# Altium schematic sheet Main.SchDoc
size 711 x 762 mm; SheetNumber: 1; SheetTotal: 1
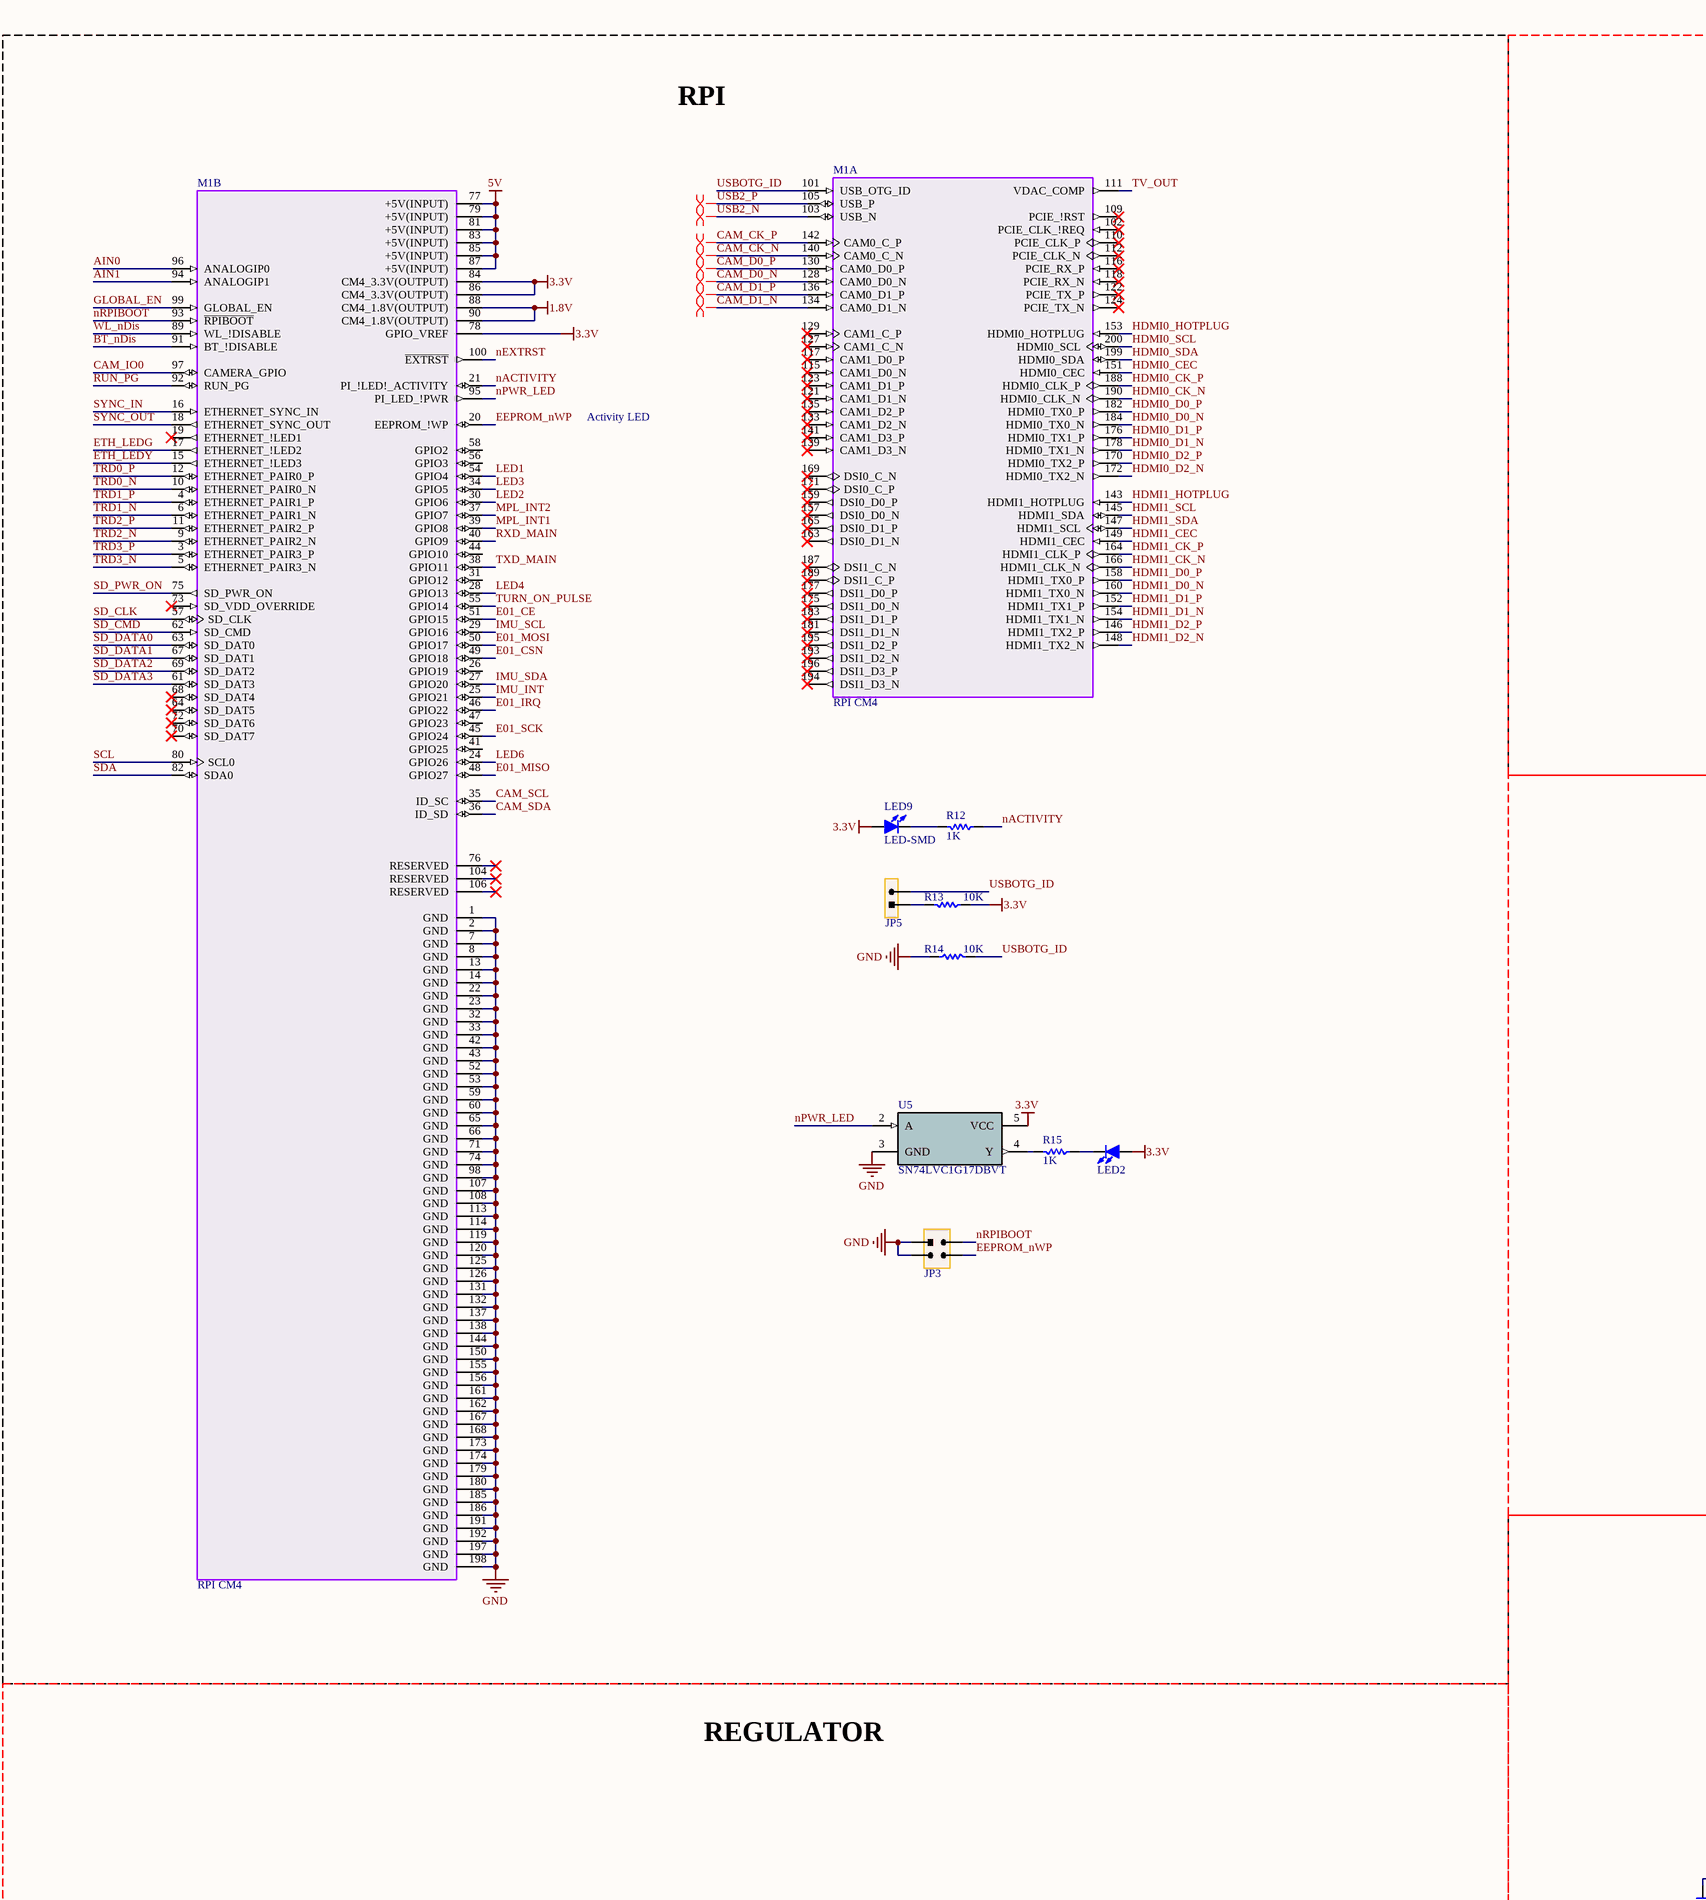
[diagram p0: Main.SchDoc, top left]
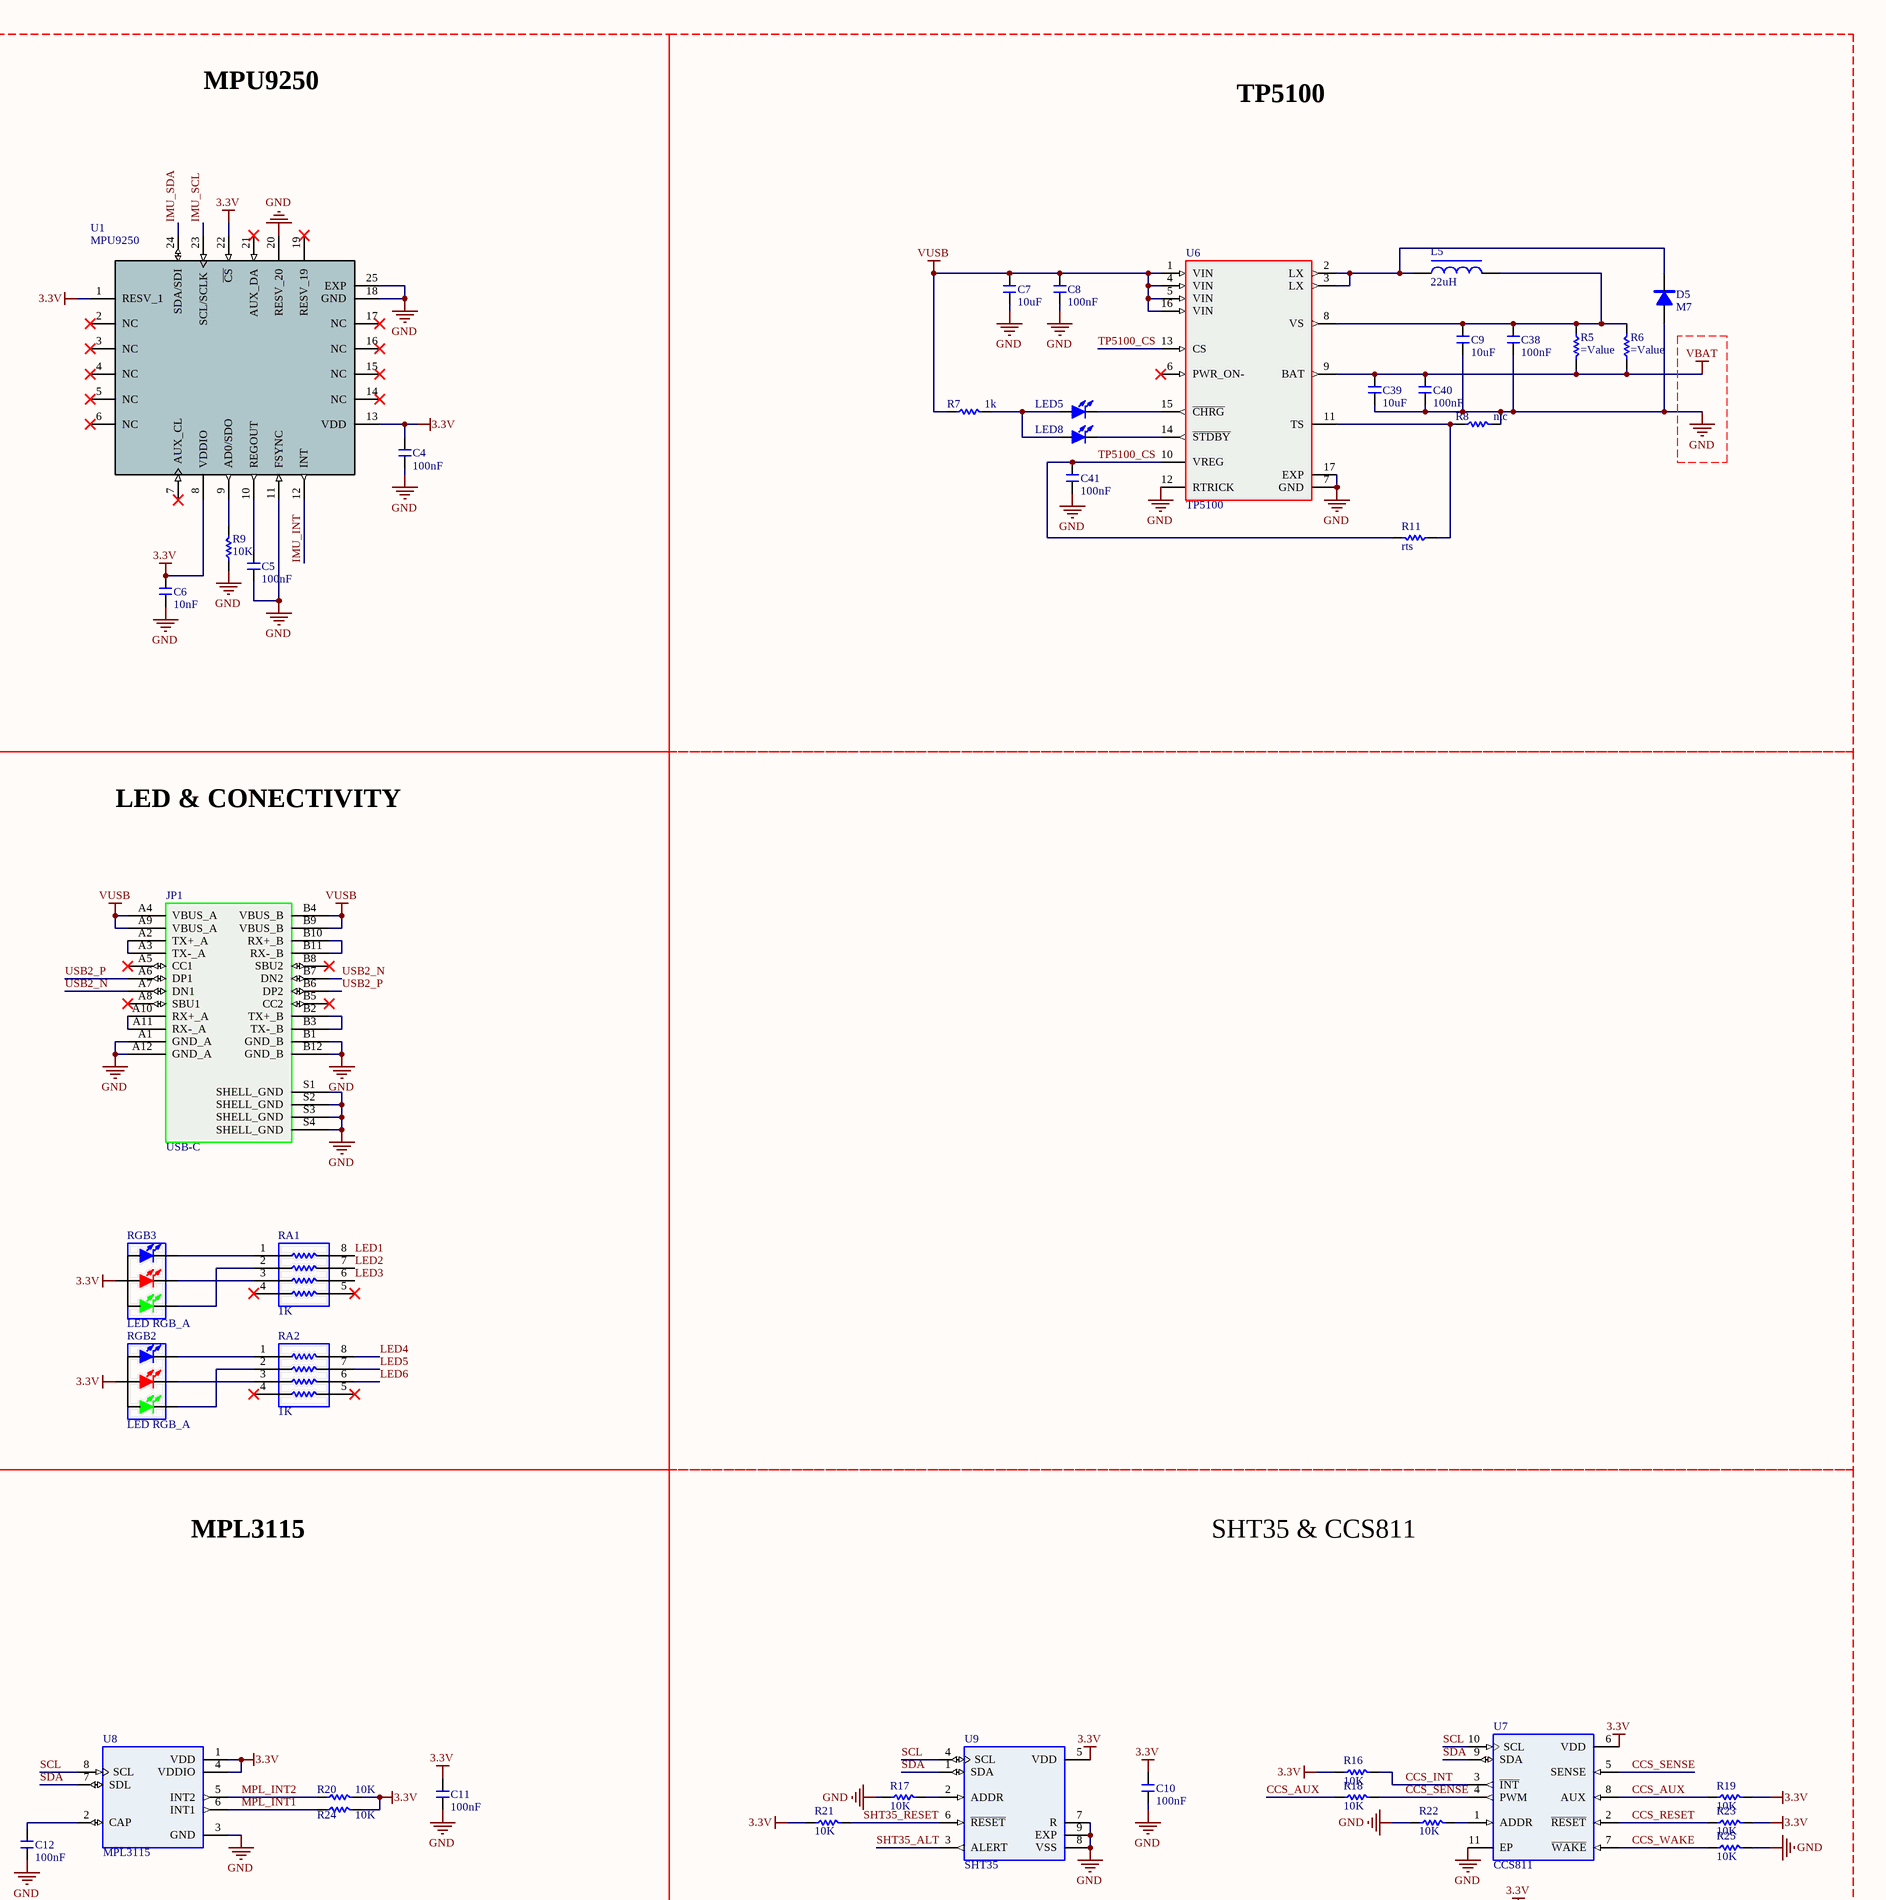
[diagram p1: Main.SchDoc, top right]
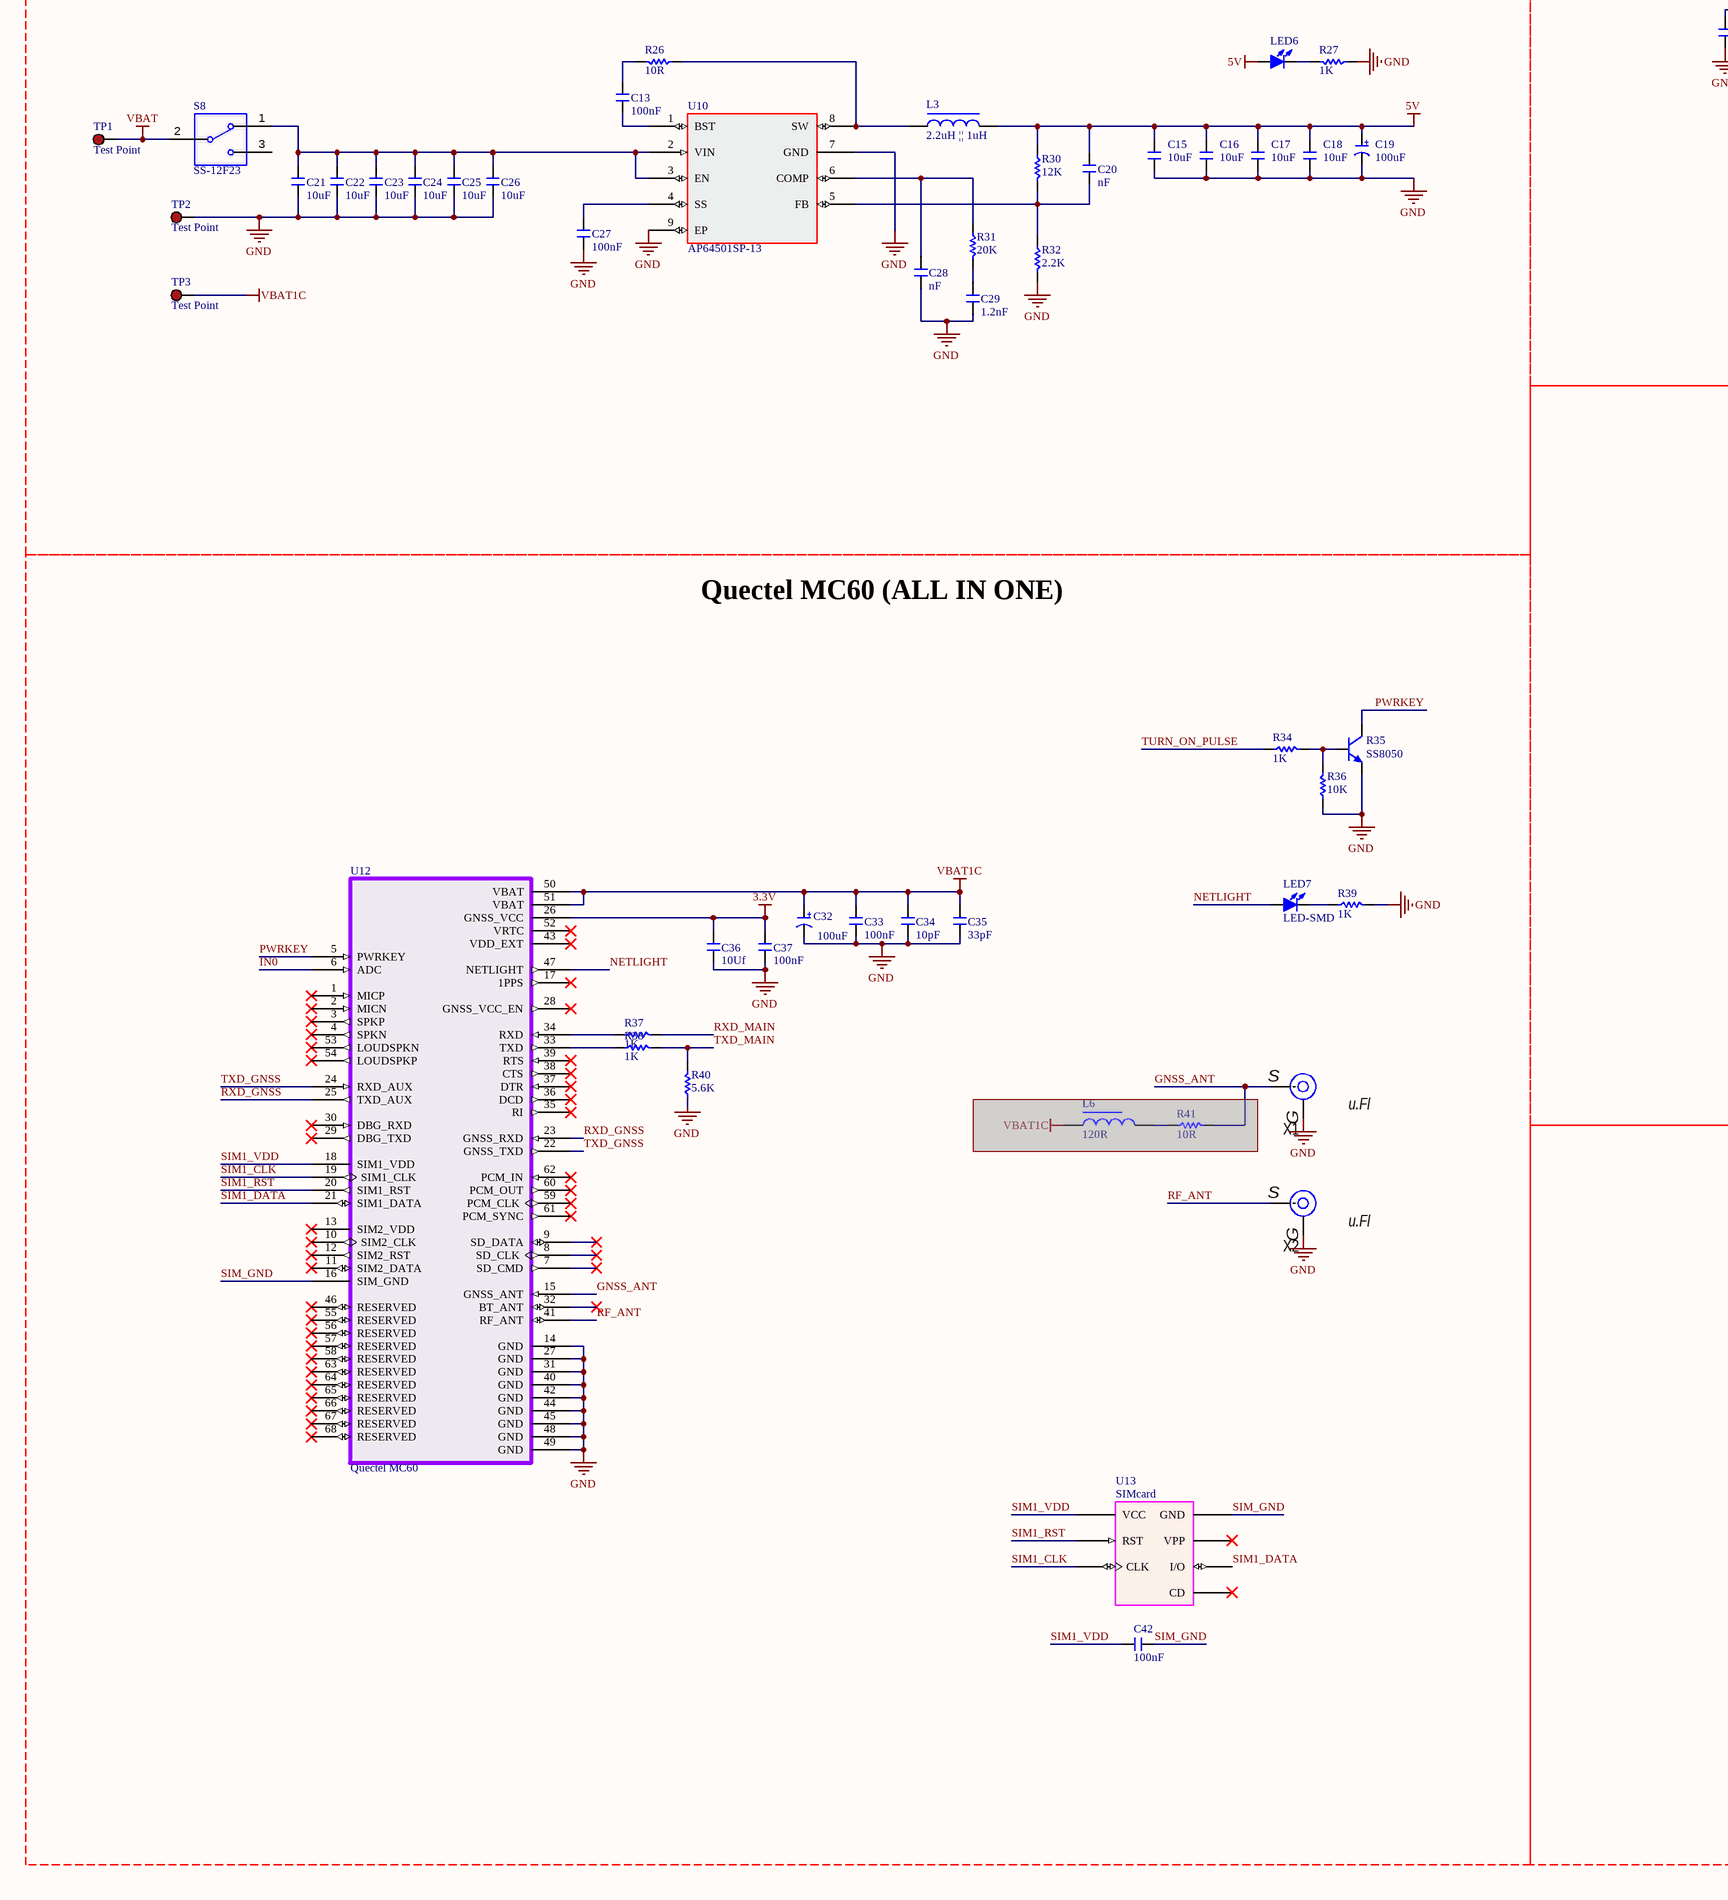
[diagram p2: Main.SchDoc, bottom left]
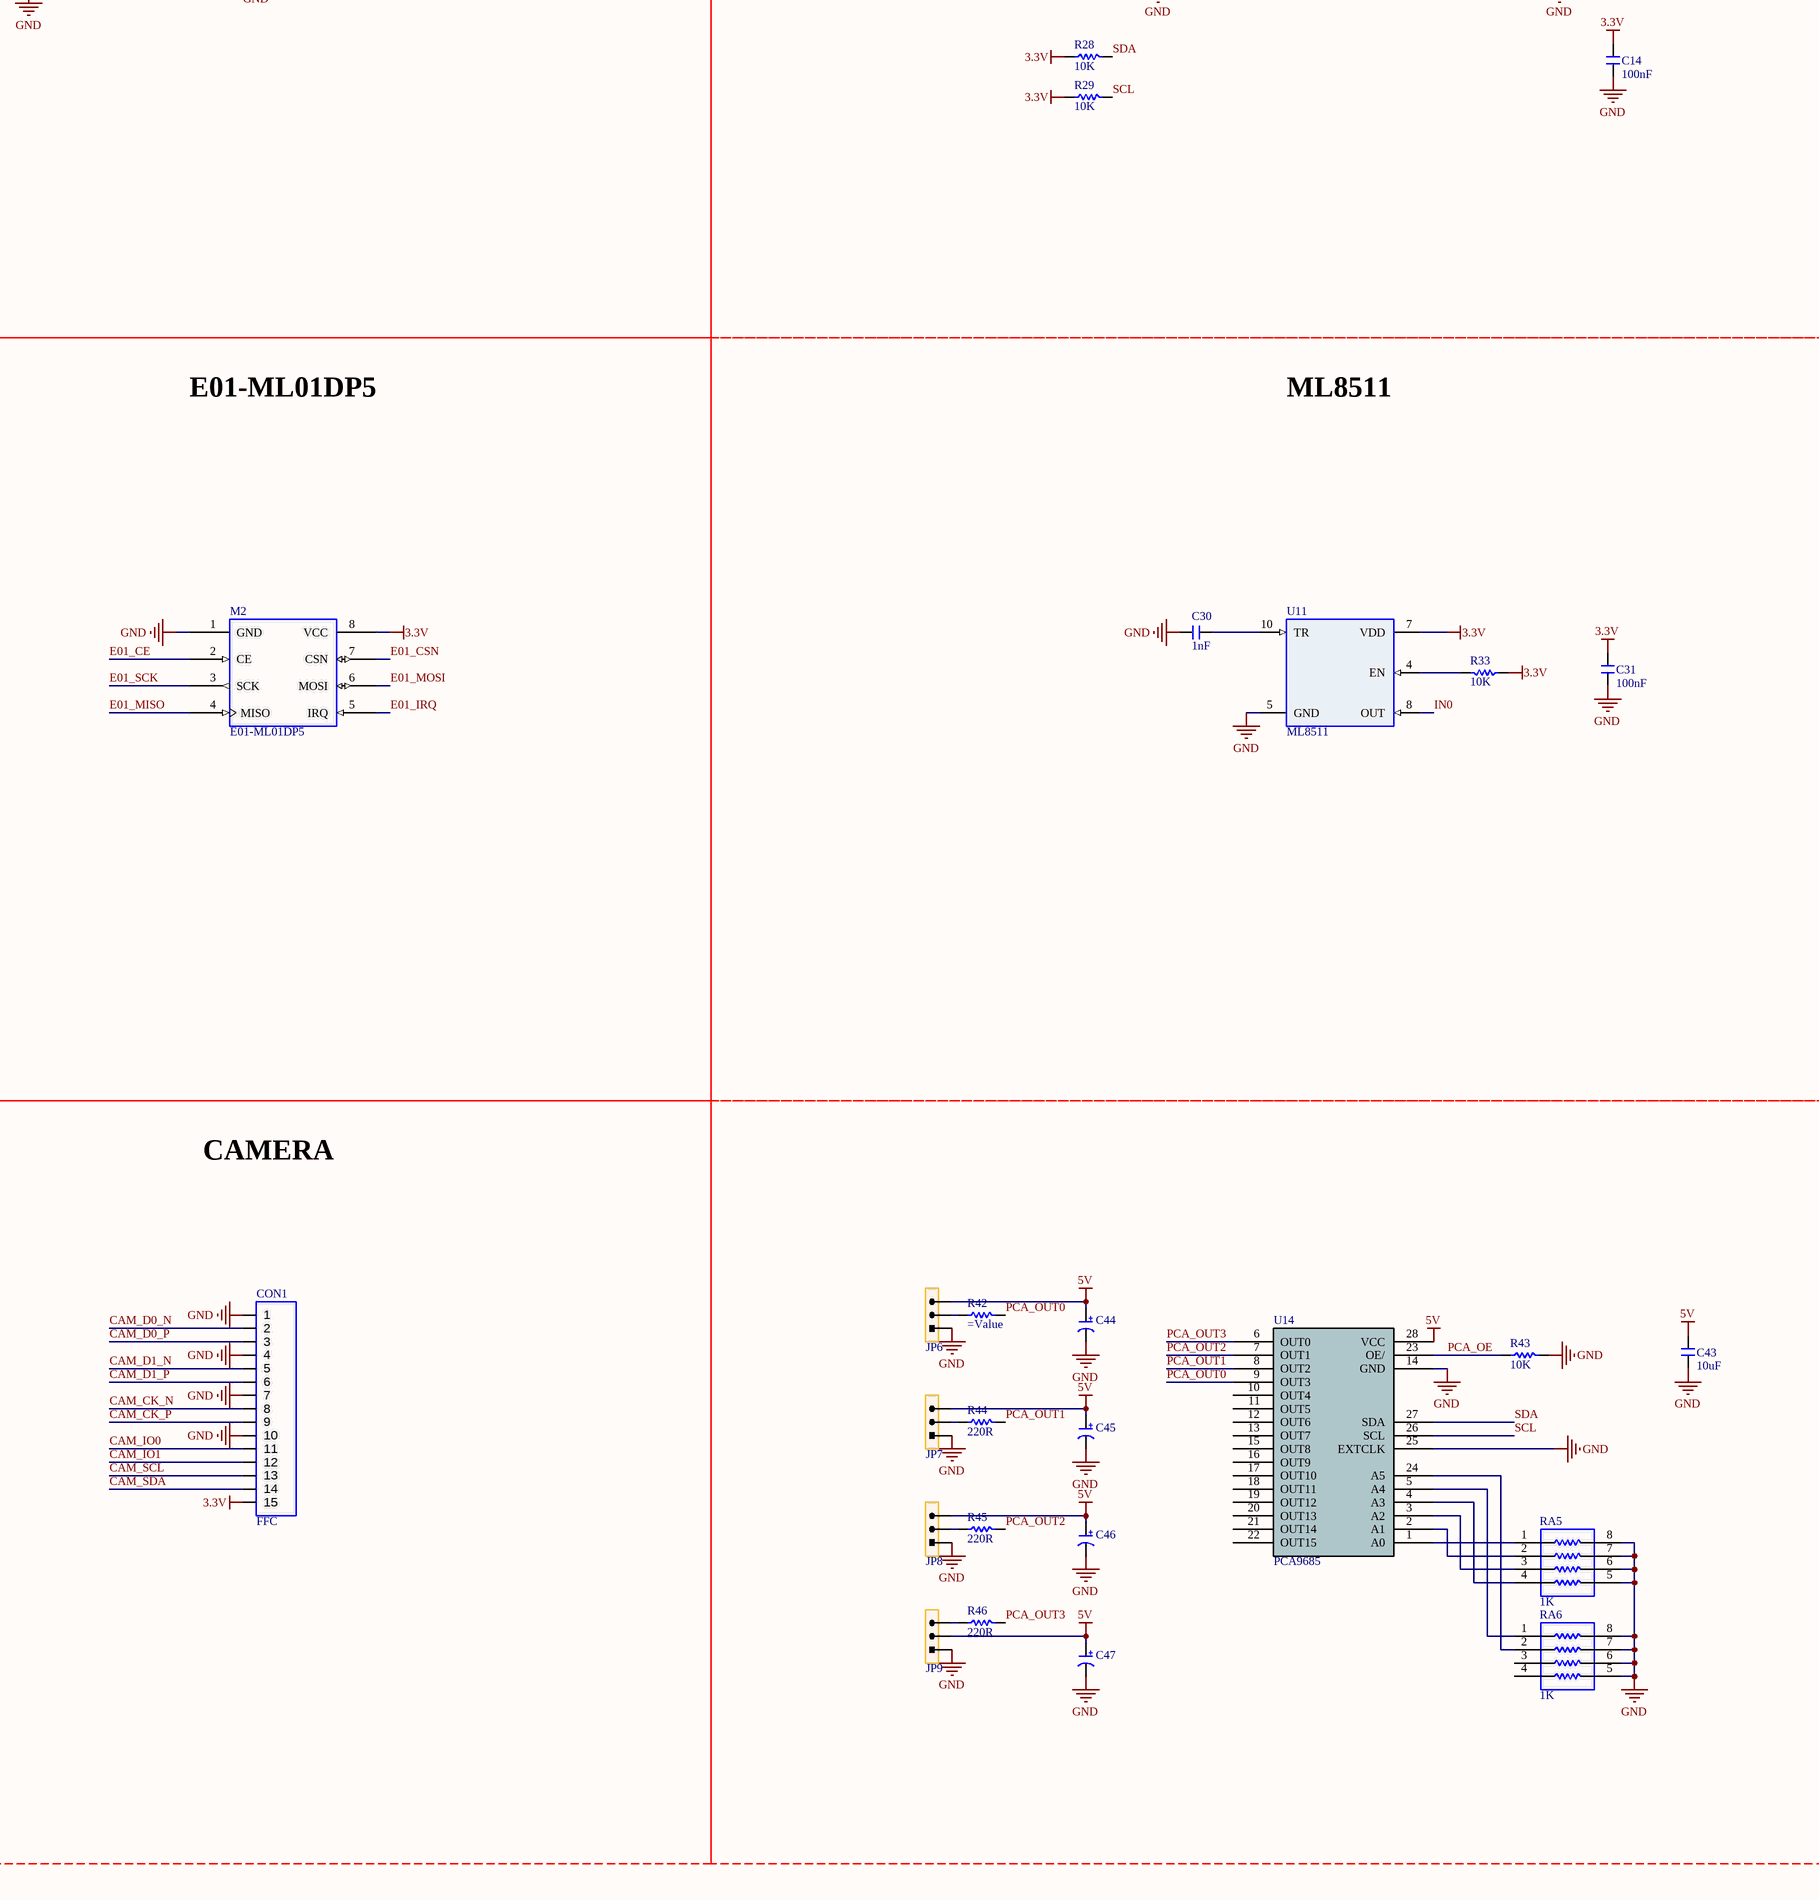
[diagram p3: Main.SchDoc, bottom right]

## Parts
C4  100nF  [C 0603]
C5  100nF  [C 0603]
C6  10nF  [C 0603]
C7  10uF  [C 0603]
C8  100nF  [C 0603]
C9  10uF  [C 0603]
C10  100nF  [C 0603]
C11  100nF  [C 0603]
C12  100nF  [C 0603]
C13  100nF  [C 0603]
C14  100nF  [C 0603]
C15  10uF  [C 0805]
C16  10uF  [C 0805]
C17  10uF  [C 0805]
C18  10uF  [C 0805]
C19  100uF  [CD D(7343)]
C20  nF  [C 0603]
C21  10uF  [C 0805]
C22  10uF  [C 0805]
C23  10uF  [C 0805]
C24  10uF  [C 0805]
C25  10uF  [C 0805]
C26  10uF  [C 0805]
C27  100nF  [C 0603]
C28  nF  [C 0603]
C29  1.2nF  [C 0603]
C30  1nF  [C 0603]
C31  100nF  [C 0603]
C32  100uF  [CD C(6032)]
C33  100nF  [C 0603]
C34  10pF  [C 0603]
C35  33pF  [C 0603]
C36  10Uf  [C 0603]
C37  100nF  [C 0603]
C38  100nF  [C 0603]
C39  10uF  [C 0603]
C40  100nF  [C 0603]
C41  100nF  [C 0603]
C42  100nF  [C 0603]
C43  10uF  [C 0603]
C44  (no value)  [CD C(6032)]
C45  (no value)  [CD C(6032)]
C46  (no value)  [CD C(6032)]
C47  (no value)  [CD C(6032)]
CON1  FFC  [FFC_0.5_15]
D5  M7  [SMA]
JP1  USB-C  [USB-C-RIGHT]
JP3  Header2X2  [HDR-2X2]  (value not drawn)
JP5  HDR-1X2  [HDR-1X2]  (value not drawn)
JP6  HDR-1X3  [XH2.54-3P]  (value not drawn)
JP7  HDR-1X3  [XH2.54-3P]  (value not drawn)
JP8  HDR-1X3  [XH2.54-3P]  (value not drawn)
JP9  HDR-1X3  [XH2.54-3P]  (value not drawn)
L3  2.2uH || 1uH  [CD53]
L5  22uH  [CD54]
L6  120R  [L 0805]  (masked out: inside a compile mask, not in the netlist)
LED2  LED-SMD  [LED 0603R]  (value not drawn)
LED5  LED-SMD  [LED 0603R]  (value not drawn)
LED6  LED-SMD  [LED 0603R]  (value not drawn)
LED7  LED-SMD  [LED 0603Y]
LED8  LED-SMD  [LED 0603B]  (value not drawn)
LED9  LED-SMD  [LED 0603Y]
M1  RPI CM4  [CM4]  (parts A,B of 2)
M2  E01-ML01DP5  [E01-ML01DP5]
R5  (no value)  [R 0805]
R6  (no value)  [R 0805]
R7  1k  [R 0603]
R8  ntc  [R 0603]
R9  10K  [R 0603]
R11  rts  [R 0603]
R12  1K  [R 0603]
R13  10K  [R 0603]
R14  10K  [R 0603]
R15  1K  [R 0603]
R16  10K  [R 0603]
R17  10K  [R 0603]
R18  10K  [R 0603]
R19  10K  [R 0603]
R20  10K  [R 0603]
R21  10K  [R 0603]
R22  10K  [R 0603]
R23  10K  [R 0603]
R24  10K  [R 0603]
R25  10K  [R 0603]
R26  10R  [R 0603]
R27  1K  [R 0603]
R28  10K  [R 0603]
R29  10K  [R 0603]
R30  12K  [R 0603]
R31  20K  [R 0603]
R32  2.2K  [R 0603]
R33  10K  [R 0603]
R34  1K  [R 0603]
R35  SS8050  [SOT23-3N]
R36  10K  [R 0603]
R37  1K  [R 0603]
R38  1K  [R 0603]
R39  1K  [R 0603]
R40  5.6K  [R 0603]
R41  10R  [R 0805]  (masked out: inside a compile mask, not in the netlist)
R42  (no value)  [R 0603]
R43  10K  [R 0603]
R44  220R  [R 0603]
R45  220R  [R 0603]
R46  220R  [R 0603]
RA1  1K  [RA1206 (4x0603)]
RA2  1K  [RA1206 (4x0603)]
RA5  1K  [RA1206 (4x0603)]
RA6  1K  [RA1206 (4x0603)]
RGB2  LED RGB_A  [RGB-SIDE-020-1]
RGB3  LED RGB_A  [RGB-SIDE-020-1]
S8  SS-12F23  [SS-12F23]
TP1  Test Point  [TEST_POINT_40MIL_R]
TP2  Test Point  [TEST_POINT_40MIL_R]
TP3  Test Point  [TEST_POINT_40MIL_R]
U1  MPU9250  [QFN40-25N]
U5  SN74LVC1G17DBVT  [SOT23-5M]
U6  TP5100  [QFN16]
U7  CCS811  [CCS811]
U8  MPL3115  [MPL3115]
U9  SHT35  [SHT35]
U10  AP64501SP-13  [SOP8_M-EP]
U11  ML8511  [ML8511]
U12  Quectel MC60  [Quectel MC60]
U13  SIMcard  [SIMcard_6pin_1]
U14  PCA9685  [SSOP28_N]
X1  u.Fl  [u.Fl 3P]
X2  u.Fl  [u.Fl 3P]

## Nets
1.8V: M1.88(CM4_1.8V(OUTPUT)) M1.90(CM4_1.8V(OUTPUT))
3.3V: C4.1 C6.1 C10.1 C11.2 C14.1 C31.2 C36.1 C37.1 CON1.15 LED2.1(A) LED9.1(A) M1.78(GPIO_VREF) M1.84(CM4_3.3V(OUTPUT)) M1.86(CM4_3.3V(OUTPUT)) M2.8(VCC) R13.1 R16.1 R19.2 R20.2 R21.1 R23.2 R24.2 R28.1 R29.1 R33.1 RGB2.3(RED_A) RGB3.3(RED_A) U1.1(RESV_1) U1.8(VDDIO) U1.13(VDD) U1.22(~{CS}) U5.5(VCC) U7.6(VDD) U8.1(VDD) U8.4(VDDIO) U9.5(VDD) U11.7(VDD) U12.26(GNSS_VCC)
5V: C15.1 C16.1 C17.1 C18.1 C19.1(A) C20.1 C43.2 C44.1(A) C45.1(A) C46.1(A) C47.1(A) JP6.3 JP7.3 JP8.3 JP9.2 L3.2 LED6.1(A) M1.77(+5V(INPUT)) M1.79(+5V(INPUT)) M1.81(+5V(INPUT)) M1.83(+5V(INPUT)) M1.85(+5V(INPUT)) M1.87(+5V(INPUT)) R30.1 U14.28(VCC)
GND: C4.2 C5.2 C6.2 C7.1 C8.1 C9.1 C10.2 C11.1 C12.1 C14.2 C15.2 C16.2 C17.2 C18.2 C19.2(K) C21.2 C22.2 C23.2 C24.2 C25.2 C26.2 C27.2 C28.2 C29.2 C30.1 C31.1 C32.2(K) C33.2 C34.2 C35.2 C36.2 C37.2 C38.1 C39.1 C40.1 C41.1 C43.1 C44.2(K) C45.2(K) C46.2(K) C47.2(K) CON1.1 CON1.4 CON1.7 CON1.10 D5.1(A) JP1.A1(GND_A) JP1.A12(GND_A) JP1.B1(GND_B) JP1.B12(GND_B) JP1.S1(SHELL_GND) JP1.S2(SHELL_GND) JP1.S3(SHELL_GND) JP1.S4(SHELL_GND) JP3.1 JP3.3 JP6.1 JP7.1 JP8.1 JP9.1 M1.1(GND) M1.2(GND) M1.7(GND) M1.8(GND) M1.13(GND) M1.14(GND) M1.22(GND) M1.23(GND) M1.32(GND) M1.33(GND) M1.42(GND) M1.43(GND) M1.52(GND) M1.53(GND) M1.59(GND) M1.60(GND) M1.65(GND) M1.66(GND) M1.71(GND) M1.74(GND) M1.98(GND) M1.107(GND) M1.108(GND) M1.113(GND) M1.114(GND) M1.119(GND) M1.120(GND) M1.125(GND) M1.126(GND) M1.131(GND) M1.132(GND) M1.137(GND) M1.138(GND) M1.144(GND) M1.150(GND) M1.155(GND) M1.156(GND) M1.161(GND) M1.162(GND) M1.167(GND) M1.168(GND) M1.173(GND) M1.174(GND) M1.179(GND) M1.180(GND) M1.185(GND) M1.186(GND) M1.191(GND) M1.192(GND) M1.197(GND) M1.198(GND) M2.1(GND) R8.2 R9.1 R14.1 R17.1 R22.1 R25.2 R27.1 R32.2 R35.2(E) R36.1 R39.2 R40.1 R43.2 RA5.5 RA5.6 RA5.7 RA5.8 RA6.5 RA6.6 RA6.7 RA6.8 TP2.1 U1.11(FSYNC) U1.18(GND) U1.20(RESV_20) U1.25(EXP) U5.3(GND) U6.7(GND) U6.12(RTRICK) U6.17(EXP) U7.11(EP) U8.3(GND) U9.7(R) U9.8(VSS) U9.9(EXP) U10.7(GND) U10.9(EP) U11.5(GND) U12.14(GND) U12.27(GND) U12.31(GND) U12.40(GND) U12.42(GND) U12.44(GND) U12.45(GND) U12.48(GND) U12.49(GND) U14.14(GND) U14.25(EXTCLK) X1.G(GND) X2.G(GND)
VBAT: C39.2 C40.2 R5.2 R6.1 S8.2 TP1.1 U6.9(BAT)
VBAT1C: C32.1(A) C33.1 C34.1 C35.1 TP3.1 U12.50(VBAT) U12.51(VBAT)
VUSB: C7.2 C8.2 JP1.A4(VBUS_A) JP1.A9(VBUS_A) JP1.B4(VBUS_B) JP1.B9(VBUS_B) R7.1 U6.1(VIN) U6.4(VIN) U6.5(VIN) U6.16(VIN)
AIN0: M1.96(ANALOGIP0)
AIN1: M1.94(ANALOGIP1)
BT_nDis: M1.91(BT_!DISABLE)
CAM_CK_N: CON1.8 M1.140(CAM0_C_N)
CAM_CK_P: CON1.9 M1.142(CAM0_C_P)
CAM_D0_N: CON1.2 M1.128(CAM0_D0_N)
CAM_D0_P: CON1.3 M1.130(CAM0_D0_P)
CAM_D1_N: CON1.5 M1.134(CAM0_D1_N)
CAM_D1_P: CON1.6 M1.136(CAM0_D1_P)
CAM_IO0: CON1.11 M1.97(CAMERA_GPIO)
CAM_IO1: CON1.12
CAM_SCL: CON1.13 M1.35(ID_SC)
CAM_SDA: CON1.14 M1.36(ID_SD)
CCS_AUX: R18.1 R19.1 U7.8(AUX)
CCS_INT: R16.2 U7.3(~{INT})
CCS_RESET: R23.1 U7.2(~{RESET})
CCS_SENSE: R18.2 U7.4(PWM) U7.5(SENSE)
CCS_WAKE: R25.1 U7.7(~{WAKE})
E01_CE: M1.51(GPIO15) M2.2(CE)
E01_CSN: M1.49(GPIO18) M2.7(CSN)
E01_IRQ: M1.46(GPIO22) M2.5(IRQ)
E01_MISO: M1.48(GPIO27) M2.4(MISO)
E01_MOSI: M1.50(GPIO17) M2.6(MOSI)
E01_SCK: M1.45(GPIO24) M2.3(SCK)
EEPROM_nWP: JP3.4 M1.20(EEPROM_!WP)
ETH_LEDG: M1.17(ETHERNET_!LED2)
ETH_LEDY: M1.15(ETHERNET_!LED3)
GLOBAL_EN: M1.99(GLOBAL_EN)
GNSS_ANT: U12.15(GNSS_ANT) X1.S(Signal)
HDMI0_CEC: M1.151(HDMI0_CEC)
HDMI0_CK_N: M1.190(HDMI0_CLK_N)
HDMI0_CK_P: M1.188(HDMI0_CLK_P)
HDMI0_D0_N: M1.184(HDMI0_TX0_N)
HDMI0_D0_P: M1.182(HDMI0_TX0_P)
HDMI0_D1_N: M1.178(HDMI0_TX1_N)
HDMI0_D1_P: M1.176(HDMI0_TX1_P)
HDMI0_D2_N: M1.172(HDMI0_TX2_N)
HDMI0_D2_P: M1.170(HDMI0_TX2_P)
HDMI0_HOTPLUG: M1.153(HDMI0_HOTPLUG)
HDMI0_SCL: M1.200(HDMI0_SCL)
HDMI0_SDA: M1.199(HDMI0_SDA)
HDMI1_CEC: M1.149(HDMI1_CEC)
HDMI1_CK_N: M1.166(HDMI1_CLK_N)
HDMI1_CK_P: M1.164(HDMI1_CLK_P)
HDMI1_D0_N: M1.160(HDMI1_TX0_N)
HDMI1_D0_P: M1.158(HDMI1_TX0_P)
HDMI1_D1_N: M1.154(HDMI1_TX1_N)
HDMI1_D1_P: M1.152(HDMI1_TX1_P)
HDMI1_D2_N: M1.148(HDMI1_TX2_N)
HDMI1_D2_P: M1.146(HDMI1_TX2_P)
HDMI1_HOTPLUG: M1.143(HDMI1_HOTPLUG)
HDMI1_SCL: M1.145(HDMI1_SDA)
HDMI1_SDA: M1.147(HDMI1_SCL)
IMU_INT: M1.25(GPIO21) U1.12(INT)
IMU_SCL: M1.29(GPIO16) U1.23(SCL/SCLK)
IMU_SDA: M1.27(GPIO20) U1.24(SDA/SDI)
IN0: U11.8(OUT) U12.6(ADC)
LED1: M1.54(GPIO4) RA1.8
LED2: M1.30(GPIO6) RA1.7
LED3: M1.34(GPIO5) RA1.6
LED4: M1.28(GPIO13) RA2.8
LED5: RA2.7
LED6: M1.24(GPIO26) RA2.6
MPL_INT1: M1.39(GPIO8) R24.1 U8.6(INT1)
MPL_INT2: M1.37(GPIO7) R20.1 U8.5(INT2)
nACTIVITY: M1.21(PI_!LED!_ACTIVITY) R12.1
NETLIGHT: LED7.1(A) U12.47(NETLIGHT)
nEXTRST: M1.100(~{EXTRST})
nPWR_LED: M1.95(PI_LED_!PWR) U5.2(A)
nRPIBOOT: JP3.2 M1.93(~{RPIBOOT})
PCA_OE: R43.1 U14.23(OE/)
PCA_OUT0: R42.2 U14.9(OUT3)
PCA_OUT1: R44.2 U14.8(OUT2)
PCA_OUT2: R45.2 U14.7(OUT1)
PCA_OUT3: R46.2 U14.6(OUT0)
PWRKEY: R35.3(C) U12.5(PWRKEY)
RF_ANT: U12.41(RF_ANT) X2.S(Signal)
RUN_PG: M1.92(RUN_PG)
RXD_GNSS: U12.23(GNSS_RXD) U12.25(TXD_AUX)
RXD_MAIN: M1.40(GPIO9) R37.2
SCL: M1.80(SCL0) R29.2 U7.10(SCL) U8.8(SCL) U9.4(SCL) U14.26(SCL)
SD_CLK: M1.57(SD_CLK)
SD_CMD: M1.62(SD_CMD)
SD_DATA0: M1.63(SD_DAT0)
SD_DATA1: M1.67(SD_DAT1)
SD_DATA2: M1.69(SD_DAT2)
SD_DATA3: M1.61(SD_DAT3)
SD_PWR_ON: M1.75(SD_PWR_ON)
SDA: M1.82(SDA0) R28.2 U7.9(SDA) U8.7(SDL) U9.1(SDA) U14.27(SDA)
SHT35_ALT: U9.3(ALERT)
SHT35_RESET: R21.2 U9.6(~{RESET})
SIM1_CLK: U12.19(SIM1_CLK) U13.C3(CLK)
SIM1_DATA: U12.21(SIM1_DATA) U13.C7(I/O)
SIM1_RST: U12.20(SIM1_RST) U13.C2(RST)
SIM1_VDD: C42.1 U12.18(SIM1_VDD) U13.C1(VCC)
SIM_GND: C42.2 U12.16(SIM_GND) U13.C5(GND)
SYNC_IN: M1.16(ETHERNET_SYNC_IN)
SYNC_OUT: M1.18(ETHERNET_SYNC_OUT)
TP5100_CS: C41.2 R11.2 U6.10(VREG) U6.13(CS)
TRD0_N: M1.10(ETHERNET_PAIR0_N)
TRD0_P: M1.12(ETHERNET_PAIR0_P)
TRD1_N: M1.6(ETHERNET_PAIR1_N)
TRD1_P: M1.4(ETHERNET_PAIR1_P)
TRD2_N: M1.9(ETHERNET_PAIR2_N)
TRD2_P: M1.11(ETHERNET_PAIR2_P)
TRD3_N: M1.5(ETHERNET_PAIR3_N)
TRD3_P: M1.3(ETHERNET_PAIR3_P)
TURN_ON_PULSE: M1.55(GPIO14) R34.1
TV_OUT: M1.111(VDAC_COMP)
TXD_GNSS: U12.22(GNSS_TXD) U12.24(RXD_AUX)
TXD_MAIN: M1.38(GPIO11) R38.2 R40.2
USB2_N: JP1.A7(DN1) JP1.B7(DN2) M1.103(USB_N)
USB2_P: JP1.A6(DP1) JP1.B6(DP2) M1.105(USB_P)
USBOTG_ID: JP5.2 M1.101(USB_OTG_ID) R14.2
WL_nDis: M1.89(WL_!DISABLE)
NetC5_1: C5.1 U1.10(REGOUT)
NetC9_2: C9.2 C38.2 L5.2 R5.1 R6.2 U6.8(VS)
NetC12_2: C12.2 U8.2(CAP)
NetC13_1: C13.1 R26.2
NetC13_2: C13.2 U10.1(BST)
NetC20_2: C20.2 R30.2 R32.1 U10.5(FB)
NetC21_1: C21.1 C22.1 C23.1 C24.1 C25.1 C26.1 S8.1 U10.2(VIN) U10.3(EN)
NetC27_1: C27.1 U10.4(SS)
NetC28_1: C28.1 R31.1 U10.6(COMP)
NetC29_1: C29.1 R31.2
NetC30_2: C30.2 U11.10(TR)
NetD5_2: D5.2(K) L5.1 U6.2(LX) U6.3(LX)
NetJP1_A2: JP1.A2(TX+_A) JP1.A3(TX-_A)
NetJP1_A10: JP1.A10(RX+_A) JP1.A11(RX-_A)
NetJP1_B2: JP1.B2(TX+_B) JP1.B3(TX-_B)
NetJP1_B10: JP1.B10(RX+_B) JP1.B11(RX-_B)
NetJP5_1: JP5.1 R13.2
NetJP6_2: JP6.2 R42.1
NetJP7_2: JP7.2 R44.1
NetJP8_2: JP8.2 R45.1
NetJP9_3: JP9.3 R46.1
NetL3_1: L3.1 R26.1 U10.8(SW)
NetLED2_2: LED2.2(K) R15.1
NetLED5_1: LED5.1(A) LED8.1(A) R7.2
NetLED5_2: LED5.2(K) U6.15(~{CHRG})
NetLED6_2: LED6.2(K) R27.2
NetLED7_2: LED7.2(K) R39.1
NetLED8_2: LED8.2(K) U6.14(~{STDBY})
NetLED9_2: LED9.2(K) R12.2
NetR8_1: R8.1 R11.1 U6.11(TS)
NetR9_2: R9.2 U1.9(AD0/SDO)
NetR15_2: R15.2 U5.4(Y)
NetR17_2: R17.2 U9.2(ADDR)
NetR22_2: R22.2 U7.1(ADDR)
NetR33_2: R33.2 U11.4(EN)
NetR34_2: R34.2 R35.1(B) R36.2
NetR37_1: R37.1 U12.34(RXD)
NetR38_1: R38.1 U12.33(TXD)
NetRA1_1: RA1.1 RGB3.1(BULE_K)
NetRA1_2: RA1.2 RGB3.2(GREEN_K)
NetRA1_3: RA1.3 RGB3.4(RED_K)
NetRA2_1: RA2.1 RGB2.1(BULE_K)
NetRA2_2: RA2.2 RGB2.2(GREEN_K)
NetRA2_3: RA2.3 RGB2.4(RED_K)
NetRA5_1: RA5.1 U14.1(A0)
NetRA5_2: RA5.2 U14.2(A1)
NetRA5_3: RA5.3 U14.3(A2)
NetRA5_4: RA5.4 U14.4(A3)
NetRA6_1: RA6.1 U14.5(A4)
NetRA6_2: RA6.2 U14.24(A5)

Not connected (* = marked no-connect by the designer): JP1 A5(CC1)* A8(SBU1)* B5(CC2)* B8(SBU2)*; M1 19(ETHERNET_!LED1)* 26(GPIO19) 31(GPIO12) 41(GPIO25) 44(GPIO10) 47(GPIO23) 56(GPIO3) 58(GPIO2) 64(SD_DAT5)* 68(SD_DAT4)* 70(SD_DAT7)* 72(SD_DAT6)* 73(SD_VDD_OVERRIDE)* 76(RESERVED)* 102(PCIE_CLK_!REQ)* 104(RESERVED)* 106(RESERVED)* 109(PCIE_!RST)* 110(PCIE_CLK_P)* 112(PCIE_CLK_N)* 115(CAM1_D0_N)* 116(PCIE_RX_P)* 117(CAM1_D0_P)* 118(PCIE_RX_N)* 121(CAM1_D1_N)* 122(PCIE_TX_P)* 123(CAM1_D1_P)* 124(PCIE_TX_N)* 127(CAM1_C_N)* 129(CAM1_C_P)* 133(CAM1_D2_N)* 135(CAM1_D2_P)* 139(CAM1_D3_N)* 141(CAM1_D3_P)* 157(DSI0_D0_N)* 159(DSI0_D0_P)* 163(DSI0_D1_N)* 165(DSI0_D1_P)* 169(DSI0_C_N)* 171(DSI0_C_P)* 175(DSI1_D0_N)* 177(DSI1_D0_P)* 181(DSI1_D1_N)* 183(DSI1_D1_P)* 187(DSI1_C_N)* 189(DSI1_C_P)* 193(DSI1_D2_N)* 194(DSI1_D3_N)* 195(DSI1_D2_P)* 196(DSI1_D3_P)*; RA1 4* 5*; RA2 4* 5*; RA6 3 4; S8 3; U1 2(NC)* 3(NC)* 4(NC)* 5(NC)* 6(NC)* 7(AUX_CL)* 14(NC)* 15(NC)* 16(NC)* 17(NC)* 19(RESV_19)* 21(AUX_DA)*; U6 6(PWR_ON-)*; U12 1(MICP)* 2(MICN)* 3(SPKP)* 4(SPKN)* 7(SD_CMD)* 8(SD_CLK)* 9(SD_DATA)* 10(SIM2_CLK)* 11(SIM2_DATA)* 12(SIM2_RST)* 13(SIM2_VDD)* 17(1PPS)* 28(GNSS_VCC_EN)* 29(DBG_TXD)* 30(DBG_RXD)* 32(BT_ANT)* 35(RI)* 36(DCD)* 37(DTR)* 38(CTS)* 39(RTS)* 43(VDD_EXT)* 46(RESERVED)* 52(VRTC)* 53(LOUDSPKN)* 54(LOUDSPKP)* 55(RESERVED)* 56(RESERVED)* 57(RESERVED)* 58(RESERVED)* 59(PCM_CLK)* 60(PCM_OUT)* 61(PCM_SYNC)* 62(PCM_IN)* 63(RESERVED)* 64(RESERVED)* 65(RESERVED)* 66(RESERVED)* 67(RESERVED)* 68(RESERVED)*; U13 C6(VPP)* CD*; U14 10(OUT4) 11(OUT5) 12(OUT6) 13(OUT7) 15(OUT8) 16(OUT9) 17(OUT10) 18(OUT11) 19(OUT12) 20(OUT13) 21(OUT14) 22(OUT15)

## Layout directives
differential pair: CAM_CK_N, CAM_CK_P, CAM_D0_N, CAM_D0_P, CAM_D1_N, CAM_D1_P, USB2_N, USB2_P

## Notes on the sheet
- MPU9250
- RPI
- TP5100
- Activity LED
- LED & CONECTIVITY
- MPL3115
- SHT35 & CCS811
- REGULATOR
- E01-ML01DP5
- ML8511
- Quectel MC60 (ALL IN ONE)
- CAMERA
- (in symbol C-CD) +

## Library data of the parts
C4-C18 C20-C31 C33-C43 = C: Non-polar patch capacitor; BOM名称: 无极性贴片电容; 版权归属: 源创客; 学习资源: www.ooocke.com
C19 C32 C44-C47 = C-CD: Solid Tantalum Chip Capacitor, Standard T491 Series - Industrial Grade; Published: 17-Jul-2002; LatestRevisionDate: 19-Mar-2004; LatestRevisionNote: Silkscreen dimensions re-sized.; DatasheetDocument: Mar-2001; PackageDocument: Mar-2001; PackageReference: B; Publisher: Altium Limited; Code_JEITA: 3528-21; ComponentLink1Description: Manufacturer Link; ComponentLink1URL: http://www.kemet.com/; ComponentLink2Description: Datasheet; ComponentLink2URL: http://www.kemet.com/kemet/web/homepage/kechome.nsf/vapubfilesname/F3102TA.pdf/$file/F3102TA.pdf
CON1 = FFC_0.5_15
D5 = M7: Rectifier diode; BOM名称: 整流二极管; 版权归属: 源创客; 学习资源: www.ooocke.com
JP1 = USB-C-RIGHT
JP3 = Header 2X2: 2*2P Connector; BOM名称: 2*2P接插件; 版权归属: 源创客; 学习资源: www.ooocke.com
JP5 = Header 2: 2P Connector; BOM名称: 2P接插件; 版权归属: 源创客; 学习资源: www.ooocke.com
JP6-JP9 = Header 3: 3P Connector; BOM名称: 3P接插件; 版权归属: 源创客; 学习资源: www.ooocke.com
L3 L5 = L-CD: Chip power inductor; BOM名称: 功率电感; 版权归属: 源创客; 学习资源: www.ooocke.com
L6 = L: Low power chip inductor; BOM名称: 小功率贴片电感; 版权归属: 源创客; 学习资源: www.ooocke.com
LED2 LED5-LED9 = LED-SMD: Patch LED; BOM名称: 贴片LED; 版权归属: 源创客; 学习资源: www.ooocke.com
M1 = CM4
R5-R9 R11-R34 R36-R46 = R: Chip resistor; 版权归属: 源创客; BOM名称: Chip resistor; 学习资源: www.ooocke.com
R35 = 8050-SMD: High frequency amplification-NPN; BOM名称: 高频放大-NPN型; 版权归属: 源创客; 属性: 40V 1.5A 1W 100MHZ; 学习资源: www.ooocke.com
RA1 RA2 RA5 RA6 = R-ARR: 4 way Chip Resistor Array
S8 = SSW-1P: 1-Way Sliding Switch; BOM名称: 波动开关; 版权归属: 源创客; 学习资源: www.ooocke.com
U5 = SN74LVC1G17DBVT: Single 1.65-V to 5.5-V buffer with Schmitt-Trigger inputs
U8 = MPL3115: Pressure Sensor
U11 = ML8511: UV Sensor
U12 = MC60: Ultra-small LCC Quad-band GSM/GPRS/GNSS Module
U13 = SIMcard (6pin)
U14 = PCA9685: 16-channel, 12-bit PWM Fm+ I2C-bus PWM LED controller , Servo Motor
X1 X2 = u.Fl 3P: RF; Manufacturer: Hirose Electric Co Ltd; Model: U.FL-R-SMT(01); HelpURL: *; ComponentKind: *